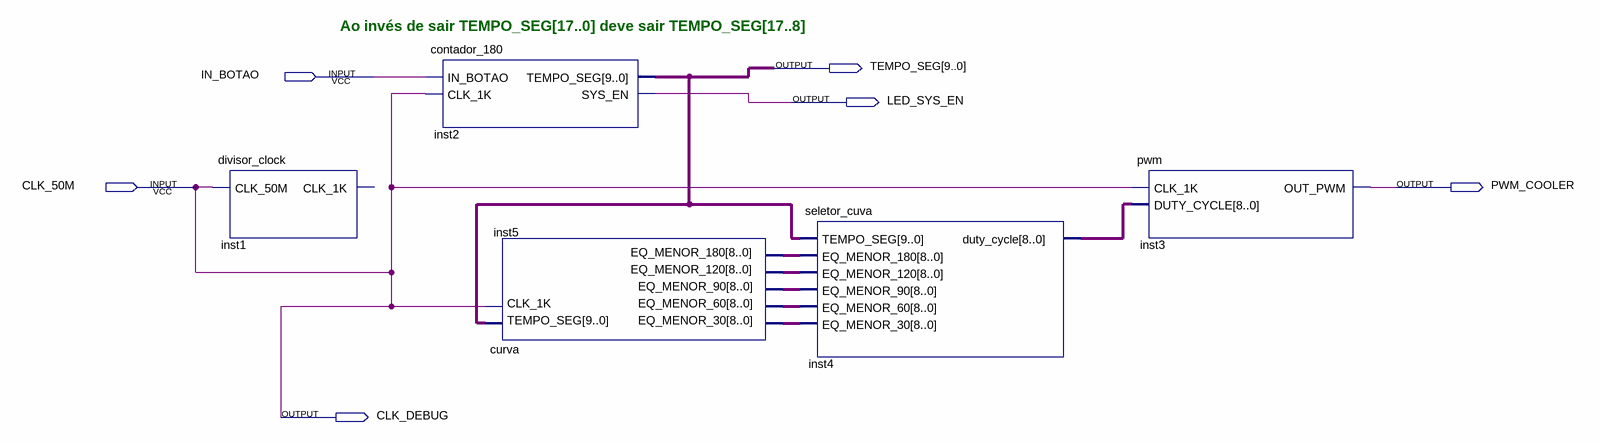
[diagram p0: schematic sheet]
// Quartus schematic main.bdf as structural Verilog: 5 symbols, 6 pins
module main (
  input  IN_BOTAO,
  input  CLK_50M,
  output [9:0] TEMPO_SEG,
  output LED_SYS_EN,
  output PWM_COOLER,
  output CLK_DEBUG
);

  wire [8:0] inst4_duty_cycle, inst5_eq_menor_30, inst5_eq_menor_60, inst5_eq_menor_90, inst5_eq_menor_120,
       inst5_eq_menor_180;

  divisor_clock inst1 (.CLK_50M(CLK_50M));  // open: CLK_1K
  contador_180 inst2 (.IN_BOTAO(IN_BOTAO), .CLK_1K(CLK_50M), .TEMPO_SEG(TEMPO_SEG), .SYS_EN(LED_SYS_EN));
  curva inst5 (
    .TEMPO_SEG(TEMPO_SEG), .CLK_1K(CLK_50M), .EQ_MENOR_30(inst5_eq_menor_30),
    .EQ_MENOR_60(inst5_eq_menor_60), .EQ_MENOR_90(inst5_eq_menor_90), .EQ_MENOR_120(inst5_eq_menor_120),
    .EQ_MENOR_180(inst5_eq_menor_180));
  seletor_cuva inst4 (
    .TEMPO_SEG(TEMPO_SEG), .EQ_MENOR_180(inst5_eq_menor_180), .EQ_MENOR_120(inst5_eq_menor_120),
    .EQ_MENOR_90(inst5_eq_menor_90), .EQ_MENOR_60(inst5_eq_menor_60), .EQ_MENOR_30(inst5_eq_menor_30),
    .duty_cycle(inst4_duty_cycle));
  pwm inst3 (.CLK_1K(CLK_50M), .DUTY_CYCLE(inst4_duty_cycle), .OUT_PWM(PWM_COOLER));

  assign CLK_DEBUG = CLK_50M;

  // Notes on the sheet:
  //   Ao invés de sair TEMPO_SEG[17..0] deve sair TEMPO_SEG[17..8]
endmodule
